# Altium project PCB_Project_Thesis.PrjPcb
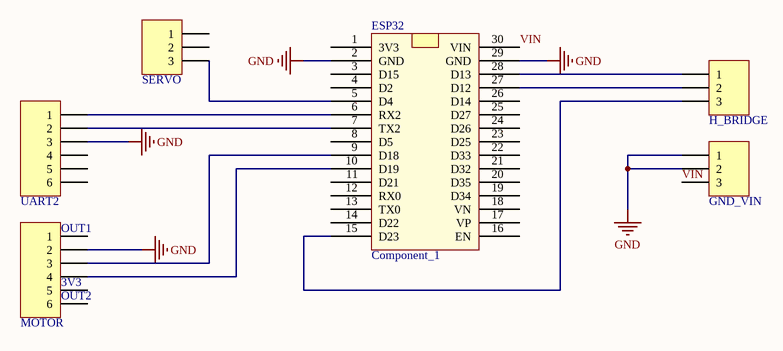
[diagram p0: Thesis_Schematic.SchDoc]
1 sheet, 6 parts. Net scope: global (net labels, ports and power ports of the same name join across sheets).
Board file: Thesis_PCB.PcbDoc

## Sheet Thesis_Schematic.SchDoc
size A

### Parts
ESP32  Component_1  [ESP32]
GND_VIN  Header 3  [JP3]  (value not drawn)
H_BRIDGE  Header 3  [JP3]  (value not drawn)
MOTOR  Header 6  [JP6]  (value not drawn)
SERVO  Header 3  [JP3]  (value not drawn)
UART2  Header 6  [JP6]  (value not drawn)

### Nets
GND: ESP32.2(GND) ESP32.29(GND) GND_VIN.1 GND_VIN.2 MOTOR.2 UART2.3
VIN: ESP32.30(VIN) GND_VIN.3
NetESP32_5: ESP32.5(D4) SERVO.3
NetESP32_6: ESP32.6(RX2) UART2.1
NetESP32_7: ESP32.7(TX2) UART2.2
NetESP32_9: ESP32.9(D18) MOTOR.3
NetESP32_10: ESP32.10(D19) MOTOR.4
NetESP32_15: ESP32.15(D23) H_BRIDGE.3
NetESP32_27: ESP32.27(D12) H_BRIDGE.2
NetESP32_28: ESP32.28(D13) H_BRIDGE.1

Not connected (* = marked no-connect by the designer): ESP32 1(3V3) 3(D15) 4(D2) 8(D5) 11(D21) 12(RX0) 13(TX0) 14(D22) 16(EN) 17(VP) 18(VN) 19(D34) 20(D35) 21(D32) 22(D33) 23(D25) 24(D26) 25(D27) 26(D14); MOTOR 1 5 6; SERVO 1 2; UART2 4 5 6

### Notes on the sheet
- (near MOTOR) OUT1
- (near MOTOR) 3V3
- (near MOTOR) OUT2

### Library data of the parts
GND_VIN H_BRIDGE SERVO = Header 3: Header, 3-Pin; LatestRevisionDate: 17-Jul-2002; LatestRevisionNote: Re-released for DXP Platform.; Publisher: Altium Limited
MOTOR UART2 = Header 6: Header, 6-Pin; LatestRevisionDate: 17-Jul-2002; LatestRevisionNote: Re-released for DXP Platform.; Publisher: Altium Limited